# EAGLE design working (EAGLE 6.5.0)
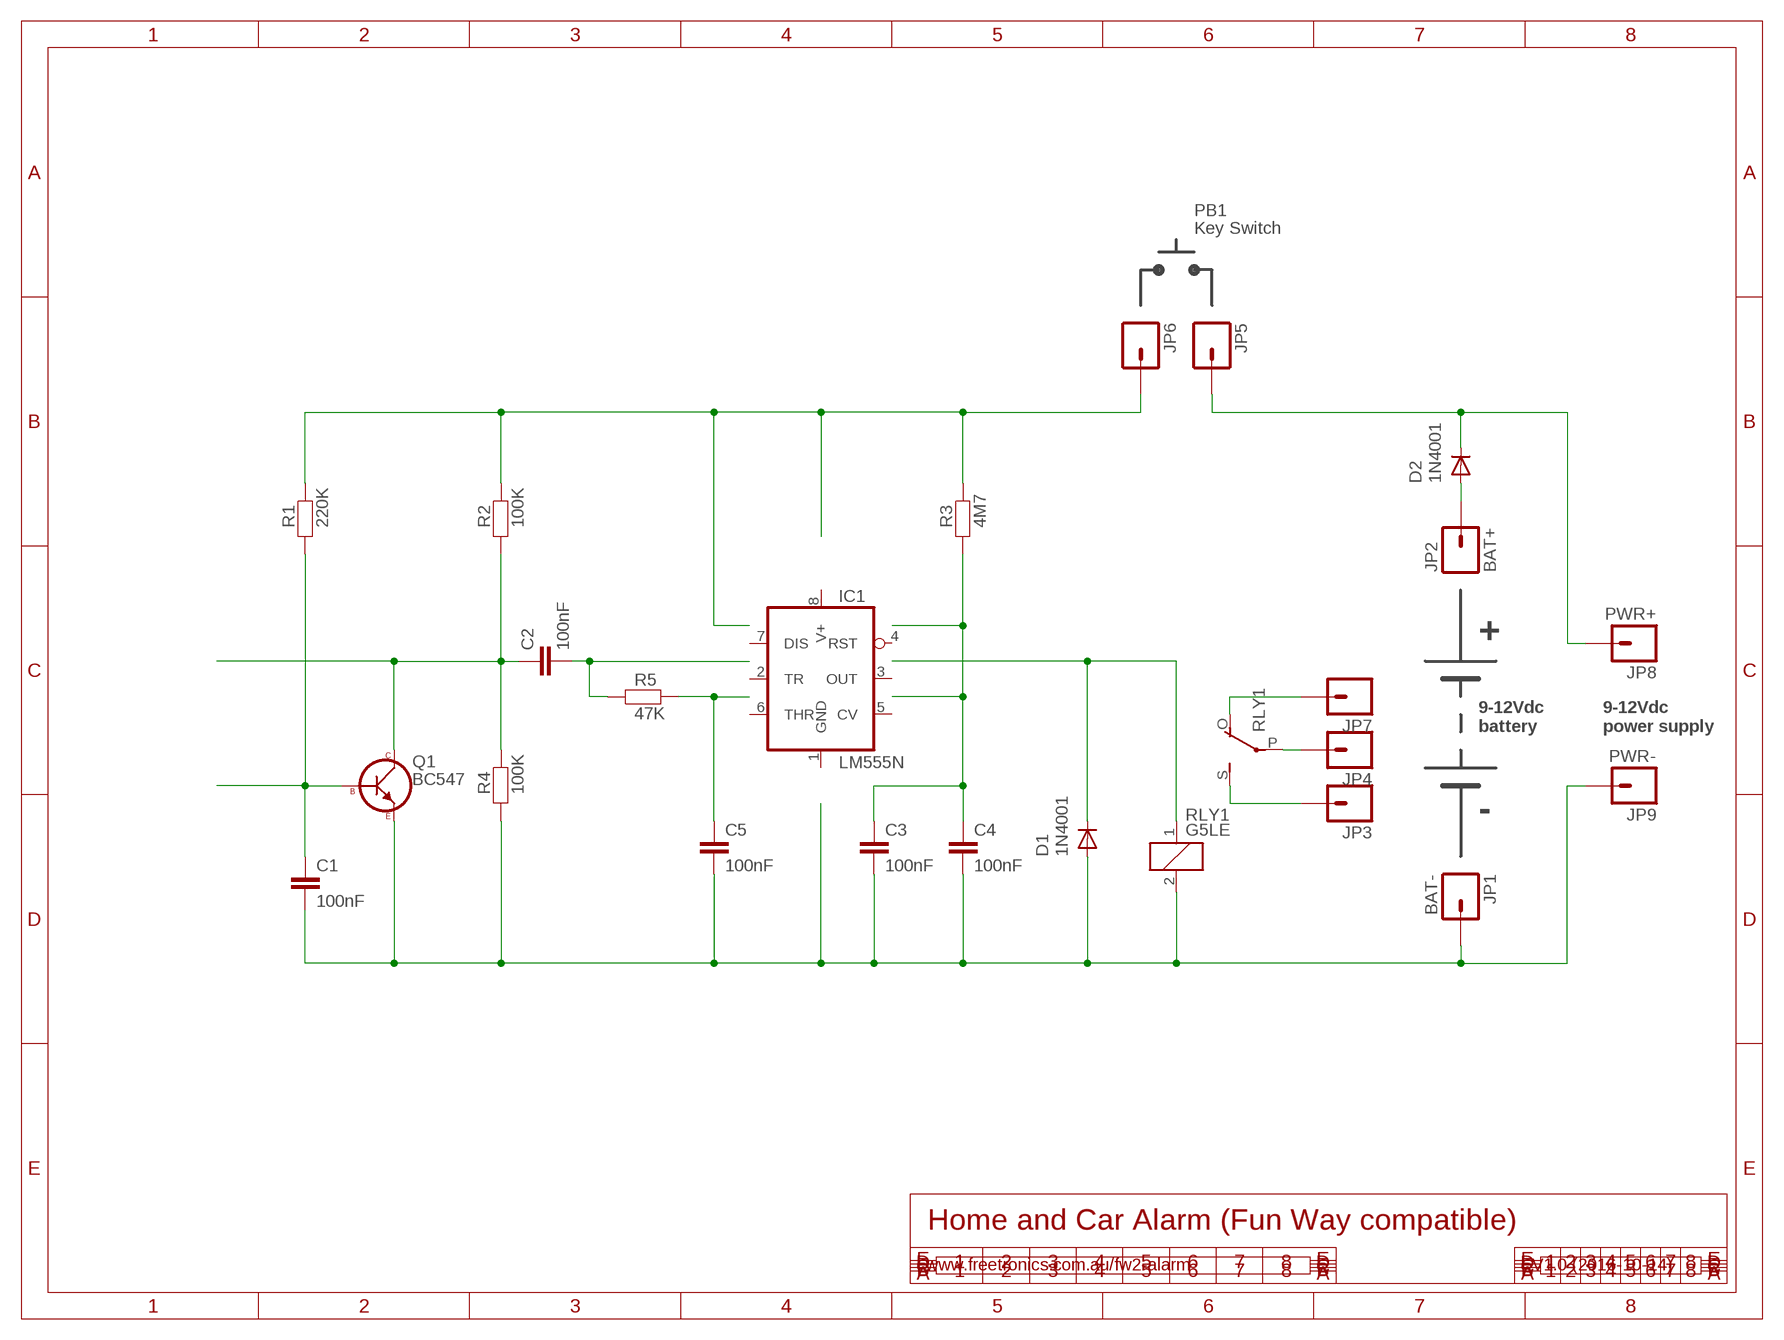
[diagram p0: schematic, sheet 1]

## Parts
C1  100nF  CAPPTH  [CAP-PTH-SMALL]
C2  100nF  CAPPTH  [CAP-PTH-SMALL]
C3  100nF  CAPPTH  [CAP-PTH-SMALL]
C4  100nF  CAPPTH  [CAP-PTH-SMALL]
C5  100nF  CAPPTH  [CAP-PTH-SMALL]
D1  1N4001  DIODEPTH  [DIODE-1N4001]
D2  1N4001  DIODEPTH  [DIODE-1N4001]
IC1  LM555N  [DIL08]
JP1  BAT-  M01PTH  [1X01]
JP2  BAT+  M01PTH  [1X01]
JP3  SPKR+  M01PTH  [1X01]
JP4  SPKR-  M01PTH  [1X01]
JP5  PWR-  M01PTH  [1X01]
JP6  PWR-  M01PTH  [1X01]
JP7  SPKR-  M01PTH  [1X01]
JP8  PWR+  M01PTH  [1X01]
JP9  PWR-  M01PTH  [1X01]
Q1  BC547  [TO-92]
R1  220K  FREETRONICS_RESISTORPTH2  [FREETRONICS_AXIAL-0.4]
R2  100K  FREETRONICS_RESISTORPTH2  [FREETRONICS_AXIAL-0.4]
R3  4M7  FREETRONICS_RESISTORPTH2  [FREETRONICS_AXIAL-0.4]
R4  100K  FREETRONICS_RESISTORPTH2  [FREETRONICS_AXIAL-0.4]
R5  47K  FREETRONICS_RESISTORPTH2  [FREETRONICS_AXIAL-0.4]
RLY1  G5LE  [G5LE]

## Nets
N$1: C3.1 C4.1 R3.P$1
N$2: C1.2 C3.2 C4.2 C5.2 D1.A JP1.1 JP9.1 Q1.3(E) R4.P$1 RLY1.2
N$3: D1.C RLY1.1
N$4: JP6.1 R1.P$2 R2.P$2 R3.P$2
N$5: JP4.1 RLY1.P(2:P)
N$6: JP3.1 RLY1.S(2:S)
N$7: JP7.1 RLY1.O(2:O)
N$8: C5.1 R5.P$2
N$9: C1.1 Q1.2(B) R1.P$1
N$10: C2.1 Q1.1(C) R2.P$1 R4.P$2
N$11: C2.2 R5.P$1
N$12: D2.A JP2.1
N$13: D2.C JP5.1 JP8.1
Unconnected: IC1.2(TR) IC1.3(OUT) IC1.4(RST) IC1.5(CV) IC1.6(THR) IC1.7(DIS)

## Notes on the sheet
- PB1
- Key Switch
- +
- 9-12Vdc
  battery
- 9-12Vdc
  power supply
- -
- Home and Car Alarm (Fun Way compatible)
- www.freetronics.com.au/fw2-alarm | V1.0 (2016-10-14)

## Power pins joined to a net without a drawn wire
GND: IC1.1(GND)
V+: IC1.8(V+)

## Library data of the parts
C1-C5 = freetronics-2:CAP: Capacitor Standard 0603 ceramic capacitor, and 0.1" leaded capacitor.
D1 D2 = freetronics-2:DIODE: Diode These are standard reverse protection diodes and small signal diodes. SMA package can handle up to about 1A. SOD-323 can handle about 200mA. What the SOD-323 package when ordering, there are some mfgs out there that are 5-pin packages.
IC1 = freetronics-jon:*555: TIMER
JP1-JP9 = freetronics-master-v1.1:M01: Header 1 Standard 1-pin 0.1" header. Use with straight break away headers (SKU : PRT-00116), right angle break away headers (PRT-00553), swiss pins (PRT-00743), machine pins (PRT-00117), and female headers (PRT-00115).
Q1 = freetronics-master-v1.1:BC547
R1-R5 = freetronics:FREETRONICS_RESISTOR: Resistor Basic schematic elements and footprints for 0603, 1206, and PTH 1/10th watt (small) resistors.
RLY1 = relay:G5LE: RELAY 1 x switch, 10 A/120 V AC, 8 A/30 V DC, Omron; OC_FARNELL: unknown; OC_NEWARK: unknown

## Board
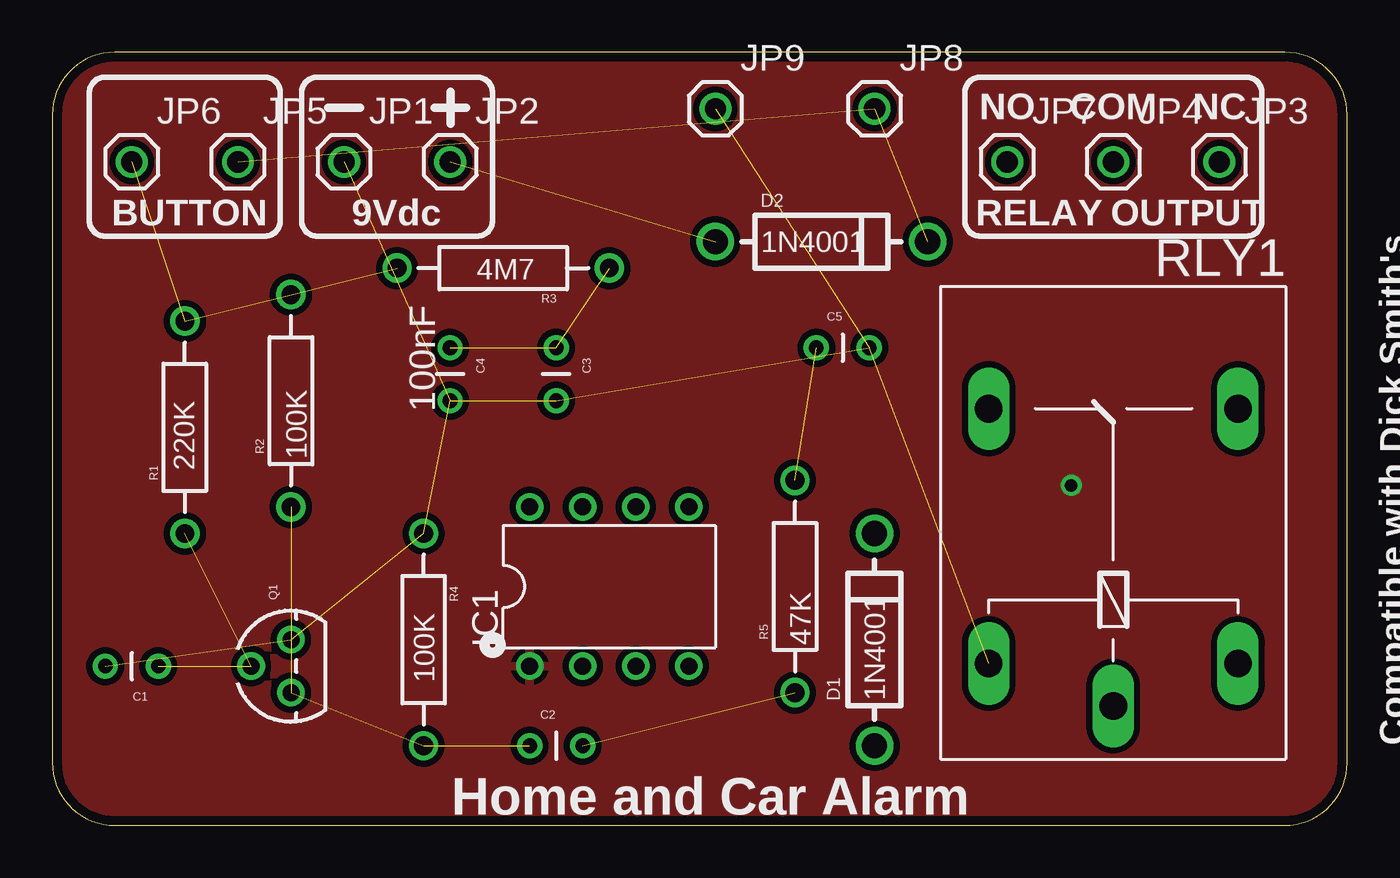
[diagram p1: board, top side]
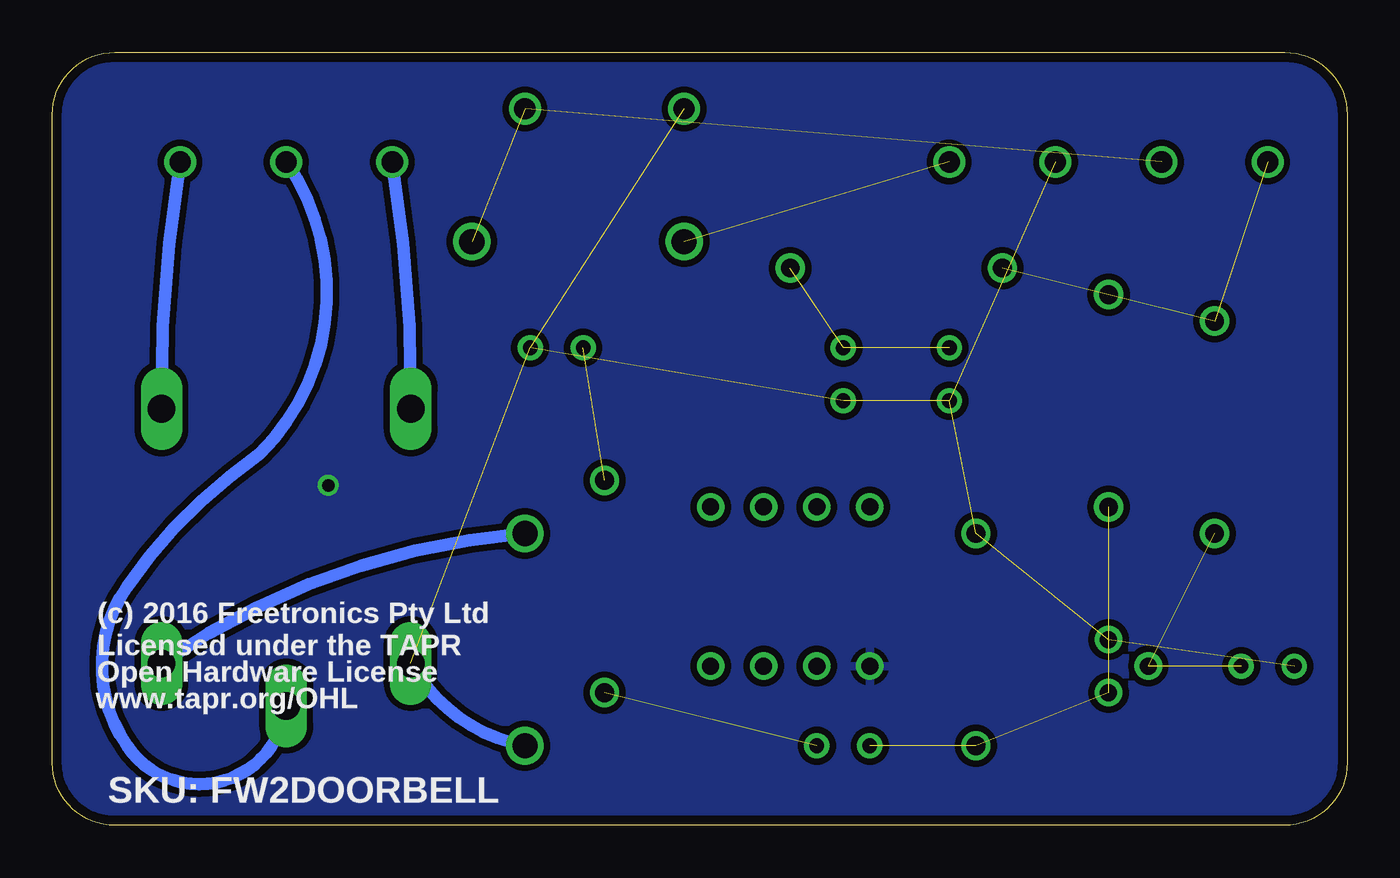
[diagram p2: board, bottom side, seen from below]

Size 62 x 37 mm. Coordinates in mm from the lower left corner, seen from the top.
Outline: 0,3 arc90 3,0 59,0 arc90 62,3 62,34 arc90 59,37 3,37 arc90 0,34 0,3
Copper layers (1*16): Top 0.035mm / dielectric 1.5mm / Bottom 0.035mm
Design rules "default *": minimum track width 10mil, minimum drill 24mil, track to track 12mil, track to pad 12mil, pad to pad 12mil, via to via 12mil, smd to smd 8mil, copper to edge 18mil, drill to drill 8mil, minimum pad ring 10mil, minimum via ring 8mil, stop-mask expansion 4mil, vias tented up to drill 25mil, thermal gap 10mil

### Footprints (pad centres in the part's own frame; a part is rotated, then mirrored left to right if it is on the bottom)
CAP-PTH-SMALL = drill 0.7: 1 0,0; 2 2.54,0
DIODE-1N4001 = drill 1.2: A -5.08,0; C 5.08,0
DIL08 = drill 0.813 pad 1.27: 1 -3.81,-3.81; 2 -1.27,-3.81; 3 1.27,-3.81; 4 3.81,-3.81; 5 3.81,3.81; 6 1.27,3.81; 7 -1.27,3.81; 8 -3.81,3.81
1X01 = drill 1.016: 1 0,0
TO-92 = drill 0.813: 1 -1.27,0; 2 0,1.905; 3 1.27,0
FREETRONICS_AXIAL-0.4 = drill 0.9: P$1 -5.08,0; P$2 5.08,0
G5LE = drill 1.321 long: 1 -7.493,-5.969; 2 -7.493,5.969; O 4.699,5.969; P -9.525,0; S 4.699,-5.969

### Placement (x,y rotation side)
C1  5.08,7.62 180 top
C2  22.86,3.81 0 top
C3  24.13,22.86 270 top
C4  19.05,22.86 270 top
C5  36.58,22.86 0 top
D1  39.37,8.89 90 top
D2  36.83,27.94 0 top
IC1  26.67,11.43 0 top
JP1  13.97,31.75 0 top
JP2  19.05,31.75 0 top
JP3  55.88,31.75 0 top
JP4  50.8,31.75 0 top
JP5  8.89,31.75 0 top
JP6  3.81,31.75 0 top
JP7  45.72,31.75 0 top
JP8  39.37,34.29 0 top
JP9  31.75,34.29 0 top
Q1  11.43,7.62 90 top
R1  6.35,19.05 90 top
R2  11.43,20.32 90 top
R3  21.59,26.67 180 top
R4  17.78,8.89 270 top
R5  35.56,11.43 90 top
RLY1  50.8,15.24 90 top

### Tracks (layer width: path | path; a pad name or v marks a point on that pad's centre or on a via)
GND  (via drill 0.6)
  other vias: 48.78,16.27
  pour Bottom: 0,34 arc-90 3,37 59,37 arc-90 62,34 62,3 arc-90 59,0 3,0 arc-90 0,3
  pour Top: 0,34 arc-90 3,37 59,37 arc-90 62,34 62,3 arc-90 59,0 3,0 arc-90 0,3
N$1  (2 unrouted)
N$2  (8 unrouted)
  Bottom 0.61: RLY1.2 arc-50 D1.A
N$3
  Bottom 0.61: RLY1.1 arc30 D1.C
N$4  (3 unrouted)
N$5
  Bottom 0.61: RLY1.P arc140 58.42,3.81 arc70 58.42,11.43 arc20 52.07,17.78 arc-80 JP4.1
N$6
  Bottom 0.61: RLY1.S arc10 JP3.1
N$7
  Bottom 0.61: RLY1.O arc-10 JP7.1
N$8  (1 unrouted)
N$9  (2 unrouted)
N$10  (3 unrouted)
N$11  (1 unrouted)
N$12  (1 unrouted)
N$13  (2 unrouted)

### Text on the board
tPlace: NO | COM | NC | + | + | BUTTON | 9Vdc | RELAY | OUTPUT | 100nF | Volume 2 | Compatible with Dick Smith's | "Fun Way Into Electronics" | Home and Car Alarm | freetronics | tron.cc/fw2-timer
bPlace: (c) 2016 Freetronics Pty Ltd | Licensed under the TAPR | Open Hardware License | www.tapr.org/OHL | SKU: FW2DOORBELL